# EAGLE design MAX31855 arduino (EAGLE 6.5.0)
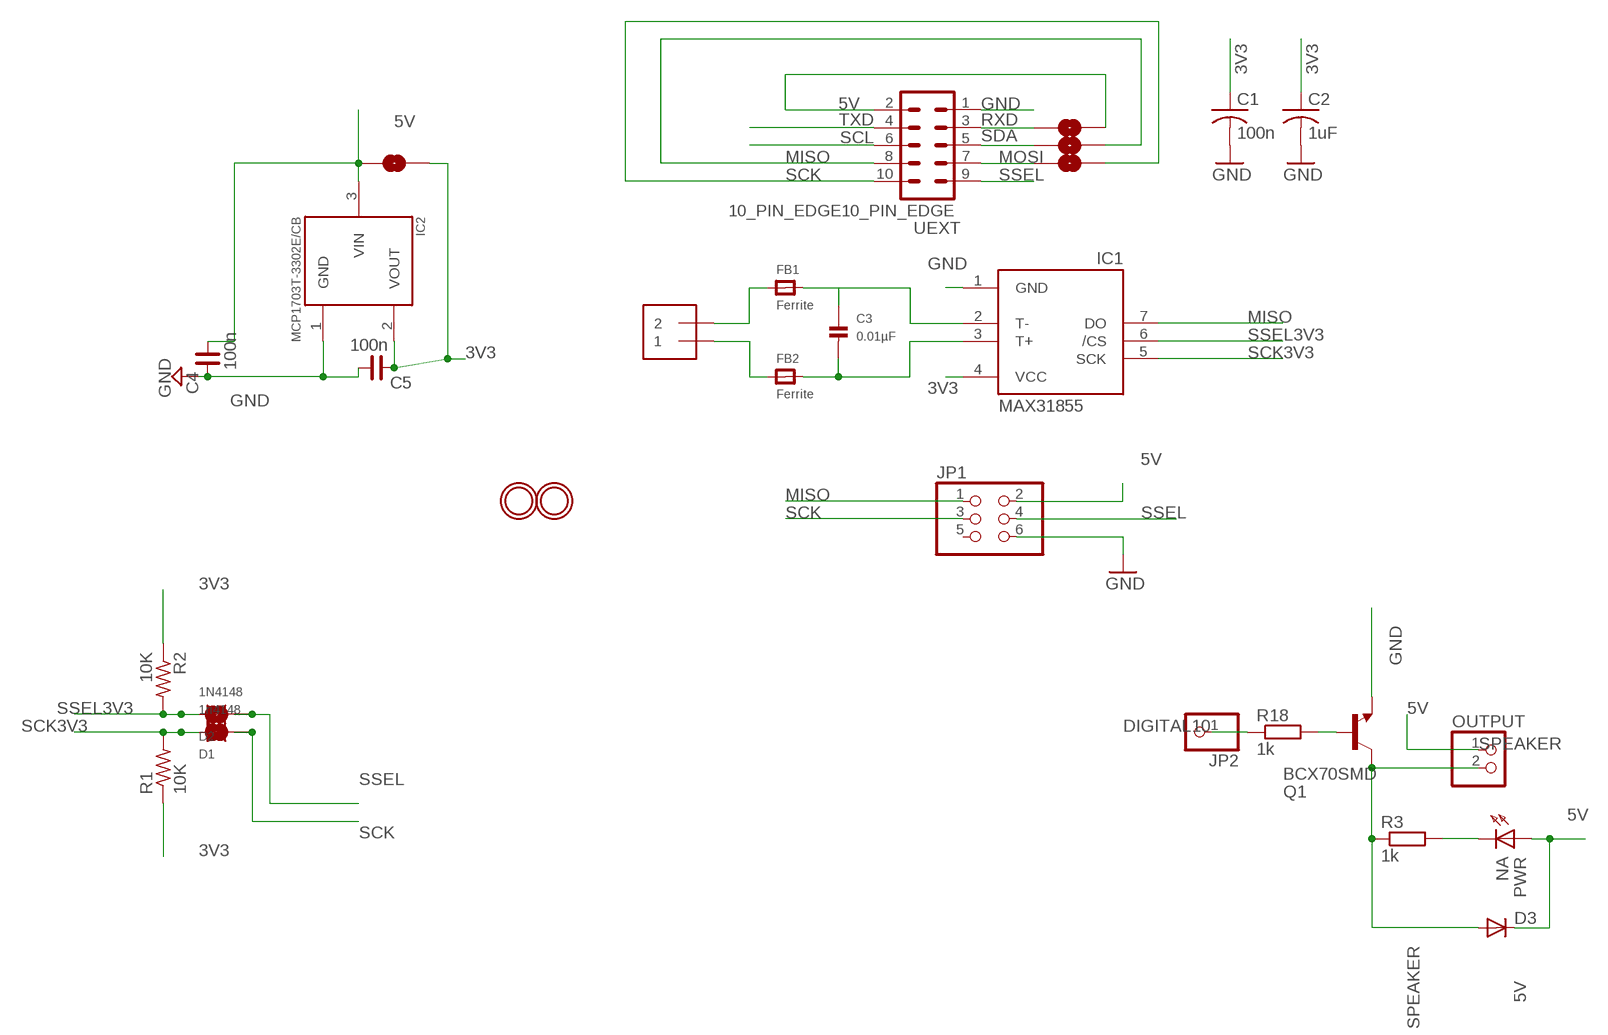
[diagram p0: schematic, sheet 1]

## Parts
3V3  SOLDERJUMPERNO  [SJ_2S-NO]
C1  100n  C-USC0805K  [C0805K]
C2  1uF  C-USC0805K  [C0805K]
C3  0.01µF  CAP_CERAMIC_0805  [_0805]
C4  100n  C_0603  [C0603]
C5  100n  C_0603  [C0603]
D1  1n4148  DIODESOD-323F  [SOD-323F]
D2  1N4148  DIODESOD-323F  [SOD-323F]
D3  DIODESOD  [SOD-323]
FB1  Ferrite  FERRITE_0805  [_0805]
FB2  Ferrite  FERRITE_0805  [_0805]
IC1  MAX31855  MAX6675  [SO08]
IC2  MCP1703T-3302E/CB  MCP1700T  [SOT23]
J1  1X2-3.5MM  [1X2-3.5MM]
JP1  PINHD-2X3  [2X03]
JP2  PINHD-1X1  [1X01]
MISO  SOLDERJUMPERNO  [SJ_2S-NO]
OUTPUT  PINHD-1X2  [1X02]
PWR  NA  LED0603DWS  [LED-0603]
Q1  BCX70SMD  [SOT23]
R1  10K  R-US_R0603  [R0603]
R2  10K  R-US_R0603  [R0603]
R3  1k  R-EU_R0603  [R0603]
R18  1k  R-EU_R0603  [R0603]
SCK  SOLDERJUMPERNO  [SJ_2S-NO]
SCK1  SOLDERJUMPERNO  [SJ_2S-NO]
SCK2  SOLDERJUMPERNO  [SJ_2S-NO]
SCK3  SOLDERJUMPERNO  [SJ_2S-NO]
U$3  10_PIN_EDGE10_PIN_EDGE  [10_PIN_EDGE]
U$4  MOUNTINGHOLE2.0  [MOUNTINGHOLE_2.0_PLATED]
U$5  MOUNTINGHOLE2.0  [MOUNTINGHOLE_2.0_PLATED]

## Nets
3V3: C1.1 C2.1 C5.2 IC1.4(VCC) IC2.2(VOUT) R1.1 R2.1 SCK3.1
5V [bat]: 3V3.2 C4.1 D3.1(C) IC2.3(VIN) JP1.2 OUTPUT.1 PWR.A SCK3.2 U$3.2
DIGITAL10: JP2.1 R18.1
GND: C1.2 C2.2 C4.2 C5.1 IC1.1(GND) IC2.1(GND) JP1.6 Q1.2(E) U$3.1
GND2 [bat]: PWR.C R3.2
MISO: IC1.7(DO) JP1.1 MISO.2 U$3.8
MOSI: SCK.1 U$3.7
N$1: FB1.1 J1.2
N$4: C3.1 FB1.2 IC1.2(T-)
N$5: FB2.1 J1.1
N$6: C3.2 FB2.2 IC1.3(T+)
N$7: Q1.1(B) R18.2
RXD: 3V3.1 U$3.3
SCK: D1.C JP1.3 SCK2.2 SCK.2 U$3.10
SCK3V3: D1.A IC1.5(SCK) R1.2 SCK2.1
SCL: U$3.6
SDA: MISO.1 U$3.5
SPEAKER: D3.2(A) OUTPUT.2 Q1.3(C) R3.1
SSEL: D2.C JP1.4 SCK1.2 U$3.9
SSEL3V3: D2.A IC1.6(/CS) R2.2 SCK1.1
TXD: U$3.4
Unconnected: JP1.5

## Notes on the sheet
- UEXT

## Library data of the parts
3V3 MISO SCK SCK1-SCK3 = SparkFun:SOLDERJUMPER: Solder Jumper Standard SMD solder jumper. Used to automate production. Two varients : Normally Open and Normally Closed are the same, but have different paste layers. NC will have a large amount of paste and should jumper during reflow.
C1 C2 = adafruit:C-US: CAPACITOR, American symbol
C3 = microbuilder:CAP_CERAMIC: Ceramic Capacitors 0402 - 0402 Surface Mount Capacitors 16pF 50V 5% [Digikey: 445-4899-2-ND] 18pF 50V 5% [Digikey: 490-1281-2-ND] 22pF 50V 5% [Digikey: 490-1283-2-ND] 68pF 50V 5% [Digikey: 490-1289-2-ND] 0.1uF 10V 10% [Digikey: 490-1318-2-ND] 1.0uF 6.3V 10% [Digikey: 490-1320-2-ND] 0603 - 0603 Surface Mount Capacitors 16 pF 50V 5% [Digikey: 445-5051-2-ND] 22 pF 50V [Digikey: PCC220ACVTR-ND] 33 pF 50V 5% [Digikey: 490-1415-1-ND] 56pF 50V 5% [Digikey: 490-1421-1-ND] 220pF 50V 5% [Digikey: 445-1285-1-ND] 680 pF 50V 2200 pF 50V 5% C0G [Digikey: 445-1297-1-ND] 5600 pF 100V 5% X7R [Digikey: 478-3711-1-ND] 0.1 µF 25V 10% [Digikey: PCC2277TR-ND] 0.22 µF 16V 10% X7R [Digikey: 445-1318-1-ND] 1.0 µF 25V 10% [Digikey: 445-5146-2-ND] 0603 - RF Specific 3pF 250V +/-0.1pF RF [Digikey: 712-1347-1-ND] 18 pF 250V 5% [Digikey: 478-3505-1-ND or 712-1322-1-ND] 56 pF 250V 5% C0G RF [Digikey: 490-4867-1-ND] 68 pF 250V RF [Digikey: 490-4868-1-ND] 0805 - 0805 Surface Mount Capacitors 220 pF 250V 2% RF Ceramic Capacitor [Digikey: 712-1398-1-ND] 1000 pF 50V 2% NP0 Ceramic Capacitor [Digikey: 478-3760-1-ND] 0.1 µF 25V 10% Ceramic Capacitor [Digikey: PCC1828TR-ND] 1.0 µF 16V 10% Ceramic Capacitor[Digikey: 490-1691-2-ND] 10.0 µF 10V 10% Ceramic Capacitor[Digikey: 709-1228-1-ND] 10.0 uF 16V 10% Ceramic Capacitor [Digikey: 478-5165-2-ND] 47 uF 6.3V 20% Ceramic Capacitor [Digikey: 587-1779-1-ND or 399-5506-1-ND] 1206 - 1206 Surface Mount Capacitors 47uF 10V 20% Ceramic Capacitor [Digikey: 490-5528-1-ND or 399-5508-1-ND or 445-6010-1-ND] 100uF 6.3V -20%, +80% Y5V Ceramic Capacitor (Digikey: 490-4512-1-ND, Mouser: 81-GRM31CF50J107ZE1L)
C4 C5 = rc-master-smd:C_: NON-POLARIZED CAP
D1 D2 = adafruit:DIODE: Diode
D3 = SparkFun:DIODE: Diode
FB1 FB2 = microbuilder:FERRITE: Ferrite Bead 0603 MMZ1608B121C - 120 Ohm @ 100MHz, 600mA, 0.15 Ohm DC Resistance - Digikey: 445-2164-1-ND BK1608HW121-T - 120 Ohm, 600mA Ferrite Chip - Digikey: 587-1876-2-ND 0805 HZ0805B272R-10 - 2.7K Ohm @ 100MHz, 200mA, 0.8 Ohm DC Resistance - Digikey: 240-2504-1-ND (see also Murata BLM21BD272SN1L) MMZ2012Y152B - 1.5K Ohm @ 100MHz, 500mA, 0.4 Ohm DC Resistance - Digikey: 445-1560-1-ND - Mainly for high frequency (80-400MHz) MMZ2012R102A - 1K Ohm @ 100MHz, 500mA, 0.3 Ohm DC Resistance - Digikey: 445-1555-2-ND - More general purpose (10-200MHz)
IC1 = adafruit:MAX6675
IC2 = okie:MCP1700T
J1 = adafruit:1X2: 3.5mm Terminal block http://www.ladyada.net/library/pcb/eaglelibrary.html
JP1 = pinhead:PINHD-2X3: PIN HEADER
JP2 = pinhead:PINHD-1X1: PIN HEADER
OUTPUT = pinhead:PINHD-1X2: PIN HEADER
PWR = DOUBLE-SIDE:LED
Q1 = transistor-npn:BCX70*: NPN Transistor
R1 R2 = adafruit:R-US_: RESISTOR, American symbol
R3 R18 = rcl:R-EU_: RESISTOR, European symbol
U$3 = eclibrary:10_PIN_EDGE
U$4 U$5 = microbuilder:MOUNTINGHOLE: Mounting Hole

## Net classes
0 default: width 0.203 mm, drill 0.381 mm, clearance 0.203 mm
1 bat: width 0.203 mm, drill 0.381 mm, clearance 0.203 mm
2 pwr: width 0.203 mm, drill 0.356 mm, clearance 0.203 mm

## Board
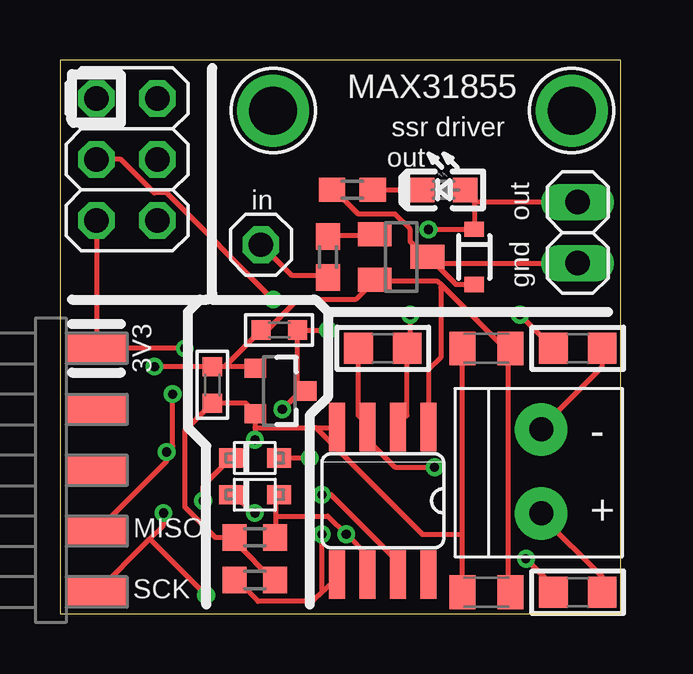
[diagram p1: board, top side]
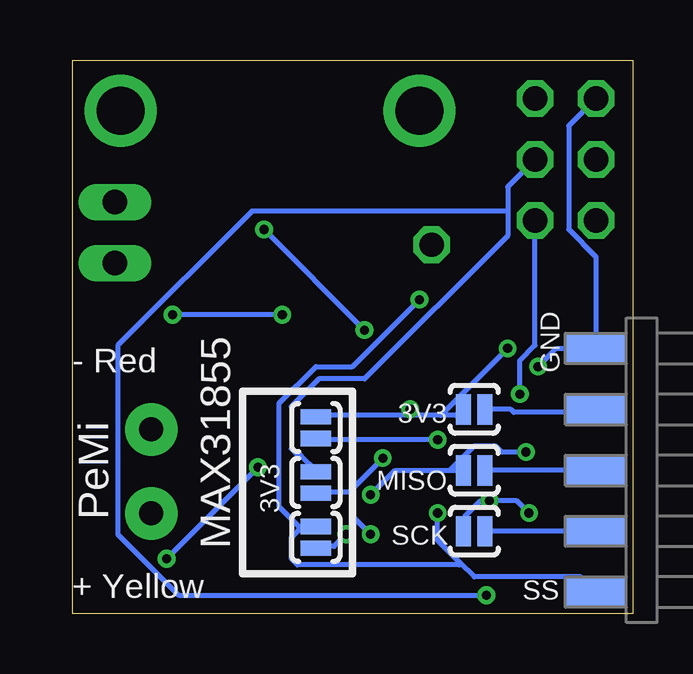
[diagram p2: board, bottom side, seen from below]

Size 23.37 x 23.06 mm. Coordinates in mm from the lower left corner, seen from the top.
Outline: 0,0 23.37,0 23.37,23.06 0,23.06 0,0
Copper layers (1*16): Top 0.0356mm / dielectric 1.5011mm / Bottom 0.0356mm
Design rules "LaenPCBOrder *": minimum track width 6mil, minimum drill 13mil, track to track 6mil, track to pad 6mil, pad to pad 6mil, via to via 6mil, smd to smd 6mil, copper to edge 15mil, drill to drill 6mil, minimum pad ring 7mil, minimum via ring 7mil, stop-mask expansion 4mil, vias tented up to drill 30mil, thermal gap 10mil

### Footprints (pad centres in the part's own frame; a part is rotated, then mirrored left to right if it is on the bottom)
SJ_2S-NO = smd 0.635 x 1.27: 1 -0.45,0; 2 0.45,0
C0805K = smd 1.1 x 1.4: 1 -1,0; 2 1,0
_0805 = smd 1.2 x 1.3: 1 -1.016,0; 2 1.016,0
C0603 = smd 0.8 x 0.8: 1 -0.762,0; 2 0.762,0
SOD-323F = smd 1 x 0.8: A -1,0; C 1,0
SOD-323 = smd 0.63 x 0.83: 1 -1.15,0; 2 1.15,0
SO08 = smd 0.66 x 2.032: 1 -1.905,-3.073; 2 -0.635,-3.073; 3 0.635,-3.073; 4 1.905,-3.073; 5 1.905,3.073; 6 0.635,3.073; 7 -0.635,3.073; 8 -1.905,3.073
SOT23 = smd 0.8 x 0.9: 1 -0.95,-1; 2 0.95,-1; 3 0,1.1
1X2-3.5MM = drill 1 pad 2.184: 1 1.8,0; 2 -1.7,0
2X03 = drill 1.016 octagon: 1 -2.54,-1.27; 2 -2.54,1.27; 3 0,-1.27; 4 0,1.27; 5 2.54,-1.27; 6 2.54,1.27
1X01 = drill 1.016 octagon: 1 0,0
1X02 = drill 1.016 long: 1 -1.27,0; 2 1.27,0
LED-0603 = smd 1.016 x 1.016: A 0.889,0; C -0.889,0
SOT23' = smd 1 x 1.4: 1 -0.95,-1.1; 2 0.95,-1.1; 3 0,1.1
R0603 = smd 1 x 1.1: 1 -0.85,0; 2 0.85,0
R0603' = smd 1.1 x 1: 1 -0.85,0; 2 0.85,0
10_PIN_EDGE = smd 1.27 x 2.54: 1 5.08,0; 3 2.54,0; 5 0,0; 7 -2.54,0; 9 -5.08,0 | smd 1.27 x 2.54 bottom: 2 5.08,0; 4 2.54,0; 6 0,0; 8 -2.54,0; 10 -5.08,0
MOUNTINGHOLE_2.0_PLATED = drill 2 pad 3: P$1 0,0

### Placement (x,y rotation side)
3V3  6.6,8.51 180 bottom
C1  17.78,11.05 0 top
C2  17.78,0.89 0 top
C3  13.46,11.05 180 top
C4  9.14,11.81 180 top
C5  6.35,9.52 270 top
D1  8.13,6.48 180 top
D2  8.13,4.95 180 top
D3  17.27,14.86 270 top
FB1  21.59,11.05 180 top
FB2  21.59,0.89 180 top
IC1  13.46,4.7 180 top
IC2  9.14,9.27 270 top
J1  20.07,5.97 270 top
JP1  2.79,18.92 90 top
JP2  8.38,15.37 0 top
MISO  6.6,5.97 180 bottom
OUTPUT  21.59,15.88 270 top
PWR  16,17.65 0 top
Q1  BCX70SMD  [SOT23']  14.22,14.86 270 top
R1  8.13,1.4 180 top
R2  8.13,3.17 0 top
R3  1k  [R0603']  12.19,17.65 0 top
R18  1k  [R0603']  11.18,14.86 90 top
SCK  6.6,3.43 180 bottom
SCK1  13.21,3.17 90 bottom
SCK2  13.21,5.46 90 bottom
SCK3  13.21,7.75 90 bottom
U$3  1.52,5.97 90 bottom
U$4  21.34,20.96 0 top
U$5  8.89,20.96 0 top

### Tracks (layer width: path | path; a pad name or v marks a point on that pad's centre or on a via)
3V3  (via drill 0.38)
  Top 0.203: 16.76,3.3 16.76,11.05 C1.1 | 16.76,3.3 16.76,0.89 C2.1 | R1.1 8.89,1.4 7.37,2.92 7.37,3.17 R2.1 6.48,3.17 5.21,4.44 5.21,7.62 C5.2 7.75,8.76 8.13,8.38 IC2.2 8.13,8.25 8.13,7.75 | 8.13,7.75 v8.13,7.24 | 8.13,7.75 10.67,7.75 | 10.67,7.75 11.56,7.75 IC1.4 | 16.76,3.3 15.11,3.3 10.67,7.75
  Bottom 0.203: v8.13,7.24 13.21,7.24 SCK3.1
5V  (via drill 0.38)
  Top 0.203: JP1.2 U$3.2 v5.21,11.05 | 17.27,17.14 17.27,17.27 PWR.A | 17.27,17.14 D3.1 v15.37,16 | OUTPUT.1 17.27,17.14 | v9.27,8.51 10.03,9.27 IC2.3 10.16,9.27 9.91,9.52 C4.1 v11.18,11.81
  Bottom 0.203: 8,8.25 7.37,8.25 7.11,8.51 3V3.2 | 8,8.25 9.27,8.25 | 9.27,8.25 13.21,8.25 SCK3.2 | 9.27,8.25 v9.27,8.51 | v11.18,11.81 v15.37,16 | 8,8.25 v5.21,11.05
DIGITAL10
  Top 0.203: JP2.1 9.65,14.1 11.18,14.1 R18.1
GND  (via drill 0.38)
  Top 0.203: 6.86,10.29 8.13,10.29 IC2.1 | 6.86,10.29 C5.1 v3.94,10.29 | 6.86,10.29 C4.2 8.64,11.81 9.91,13.08 12.32,13.08 13.08,13.84 Q1.2 13.21,13.84 15.75,13.84 15.94,13.65 | 15.94,13.65 18.54,11.05 18.67,11.05 | 18.67,11.05 18.67,0.89 C2.2 | 18.67,11.05 C1.2 | IC1.1 15.37,10.16 15.88,10.67 15.88,13.59 15.94,13.65
  Bottom 0.203: JP1.6 2.67,20.32 2.67,16 1.52,14.86 U$3.1 3.18,11.05 v3.94,10.29
GND2
  Top 0.203: R3.2 PWR.C
MISO  (via drill 0.38)
  Top 0.203: v10.92,4.95 11.3,4.95 14.1,2.16 IC1.7 | U$3.8 4.45,6.35 v4.45,6.73 4.7,6.99 v4.7,9.14
  Bottom 0.203: 7.62,5.97 9.91,5.97 v10.92,4.95 | 7.62,5.97 MISO.2 | v4.45,6.73 5.46,6.73 5.72,6.99 6.6,6.99 7.62,5.97 | JP1.1 4.06,11.18 4.7,10.54 v4.7,9.14
MOSI
  Bottom 0.203: U$3.7 SCK.1
N$1
  Top 0.203: FB1.1 22.61,10.29 20.07,7.75 J1.2
N$4  (via drill 0.38)
  Top 0.203: IC1.2 14.1,7.87 14.48,8.25 C3.1 14.6,11.18 v14.6,12.45 | v19.18,12.45 FB1.2
  Bottom 0.203: v14.6,12.45 v19.18,12.45
N$5
  Top 0.203: FB2.1 22.61,1.52 20.07,4.06 J1.1
N$6  (via drill 0.38)
  Top 0.203: C3.2 12.45,8.25 12.83,7.87 IC1.3 12.83,7.24 13.97,6.1 v15.62,6.1 | FB2.2 20.57,1.14 v19.43,2.29
  Bottom 0.203: v15.62,6.1 v19.43,2.29
N$7
  Top 0.203: R18.2 11.18,15.75 13.08,15.75 Q1.1
RXD
  Bottom 0.203: 3V3.1 5.08,8.51 4.95,8.38 1.65,8.38 U$3.3
SCK  (via drill 0.38)
  Top 0.203: v5.97,4.7 5.97,5.33 7.11,6.48 D1.C | v4.32,4.19 4.32,3.68 3.75,3.11 | U$3.10 3.75,3.11 | v6.1,0.76 3.75,3.11
  Bottom 0.203: SCK.2 6.98,3.43 6.98,4.06 6.35,4.7 v5.97,4.7 4.83,4.7 v4.32,4.19 | 5.21,16.76 5.21,17.78 JP1.3 | 5.21,16.76 5.21,15.75 11.18,9.78 13.08,9.78 14.22,8.64 14.22,6.86 13.97,6.6 13.84,6.6 13.21,5.97 SCK2.2 | v6.1,0.76 18.92,0.76 21.46,3.3 21.46,11.18 15.88,16.76 5.21,16.76
SCK3V3  (via drill 0.38)
  Top 0.203: v10.41,6.48 D1.A | 10.99,0.95 11.56,1.52 IC1.5 | 10.99,0.95 10.54,0.51 8.26,0.51 7.37,1.4 R1.2 | v10.92,3.3 10.92,1.02 10.99,0.95
  Bottom 0.203: 11.75,5.14 11.81,5.08 13.21,5.08 SCK2.1 | 11.75,5.14 v10.41,6.48 | v10.92,3.3 11.68,4.06 11.68,5.08 11.75,5.14
SDA
  Bottom 0.203: U$3.5 MISO.1
SPEAKER
  Top 0.203: D3.2 16.51,13.72 15.37,14.86 Q1.3 | R3.1 11.43,17.65 12.45,16.64 13.97,16.64 14.6,16 14.6,15.49 15.24,14.86 Q1.3 | OUTPUT.2 15.75,14.61 Q1.3
SSEL  (via drill 0.38)
  Top 0.203: v8.13,4.19 8,4.19 7.24,4.95 D2.C | JP1.4 2.54,18.92 3.94,17.53 4.45,17.53 v8.89,13.08
  Bottom 0.203: v8.13,4.19 8.13,3.05 7.17,2.1 | 7.17,2.1 6.6,1.52 2.16,1.52 U$3.9 | 13.84,3.56 13.21,3.56 SCK1.2 | 13.84,3.56 14.22,3.17 14.22,2.29 13.97,2.03 7.24,2.03 7.17,2.1 | v8.89,13.08 11.68,10.29 13.21,10.29 14.73,8.76 14.73,4.44 13.84,3.56
SSEL3V3  (via drill 0.38)
  Top 0.203: 9.02,4.06 9.02,3.17 R2.2 | 9.02,4.06 9.02,4.95 D2.A | 9.02,4.06 11.18,4.06 v11.94,3.3 12.83,2.41 IC1.6
  Bottom 0.203: v11.94,3.3 12.45,2.79 13.21,2.79 SCK1.1

### Text on the board
tPlace: - | +
bPlace: MAX31855 | - Red | PeMi | + Yellow
tNames: MAX31855 | ssr driver | out | in | out | gnd | 3V3 | MISO | SCK
bNames: GND | 3V3 | SS